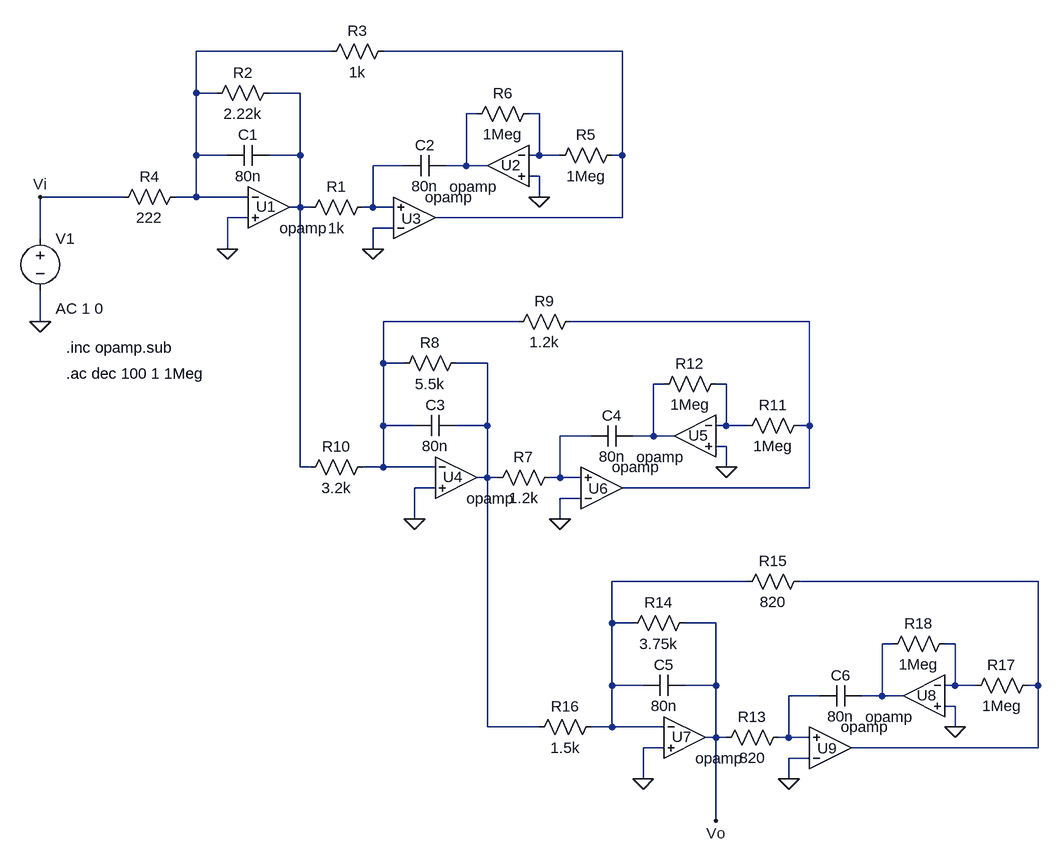
[diagram p0: schematic Ej_8.asc]
Ej_8.asc, the LTspice schematic file:
Version 4
SHEET 1 2688 1292
WIRE 208 -80 0 -80
WIRE 656 -80 288 -80
WIRE 0 -16 0 -80
WIRE 32 -16 0 -16
WIRE 160 -16 112 -16
WIRE 432 16 416 16
WIRE 528 16 512 16
WIRE 0 80 0 -16
WIRE 48 80 0 80
WIRE 160 80 160 -16
WIRE 160 80 112 80
WIRE 528 80 528 16
WIRE 528 80 512 80
WIRE 560 80 528 80
WIRE 656 80 656 -80
WIRE 656 80 640 80
WIRE 320 96 272 96
WIRE 416 96 416 16
WIRE 416 96 384 96
WIRE 448 96 416 96
WIRE 528 112 512 112
WIRE -112 144 -240 144
WIRE 0 144 0 80
WIRE 0 144 -32 144
WIRE 80 144 0 144
WIRE 528 144 528 112
WIRE 160 160 160 80
WIRE 160 160 144 160
WIRE 176 160 160 160
WIRE 272 160 272 96
WIRE 272 160 256 160
WIRE 304 160 272 160
WIRE 80 176 48 176
WIRE 656 176 656 80
WIRE 656 176 368 176
WIRE 304 192 272 192
WIRE -240 208 -240 144
WIRE 48 224 48 176
WIRE 272 224 272 192
WIRE -240 336 -240 288
WIRE 496 336 288 336
WIRE 944 336 576 336
WIRE 288 400 288 336
WIRE 320 400 288 400
WIRE 448 400 400 400
WIRE 720 432 704 432
WIRE 816 432 800 432
WIRE 288 496 288 400
WIRE 336 496 288 496
WIRE 448 496 448 400
WIRE 448 496 400 496
WIRE 816 496 816 432
WIRE 816 496 800 496
WIRE 848 496 816 496
WIRE 944 496 944 336
WIRE 944 496 928 496
WIRE 608 512 560 512
WIRE 704 512 704 432
WIRE 704 512 672 512
WIRE 736 512 704 512
WIRE 816 528 800 528
WIRE 160 560 160 160
WIRE 176 560 160 560
WIRE 288 560 288 496
WIRE 288 560 256 560
WIRE 368 560 288 560
WIRE 816 560 816 528
WIRE 448 576 448 496
WIRE 448 576 432 576
WIRE 464 576 448 576
WIRE 560 576 560 512
WIRE 560 576 544 576
WIRE 592 576 560 576
WIRE 368 592 336 592
WIRE 944 592 944 496
WIRE 944 592 656 592
WIRE 592 608 560 608
WIRE 336 640 336 592
WIRE 560 640 560 608
WIRE 848 736 640 736
WIRE 1296 736 928 736
WIRE 640 800 640 736
WIRE 672 800 640 800
WIRE 800 800 752 800
WIRE 1072 832 1056 832
WIRE 1168 832 1152 832
WIRE 640 896 640 800
WIRE 688 896 640 896
WIRE 800 896 800 800
WIRE 800 896 752 896
WIRE 1168 896 1168 832
WIRE 1168 896 1152 896
WIRE 1200 896 1168 896
WIRE 1296 896 1296 736
WIRE 1296 896 1280 896
WIRE 960 912 912 912
WIRE 1056 912 1056 832
WIRE 1056 912 1024 912
WIRE 1088 912 1056 912
WIRE 1168 928 1152 928
WIRE 448 960 448 576
WIRE 528 960 448 960
WIRE 640 960 640 896
WIRE 640 960 608 960
WIRE 720 960 640 960
WIRE 1168 960 1168 928
WIRE 800 976 800 896
WIRE 800 976 784 976
WIRE 816 976 800 976
WIRE 912 976 912 912
WIRE 912 976 896 976
WIRE 944 976 912 976
WIRE 720 992 688 992
WIRE 1296 992 1296 896
WIRE 1296 992 1008 992
WIRE 944 1008 912 1008
WIRE 688 1040 688 992
WIRE 912 1040 912 1008
WIRE 800 1104 800 976
FLAG 48 224 0
FLAG 272 224 0
FLAG 528 144 0
FLAG 336 640 0
FLAG 560 640 0
FLAG 816 560 0
FLAG 688 1040 0
FLAG 912 1040 0
FLAG 1168 960 0
FLAG 800 1104 Vo
FLAG -240 336 0
FLAG -240 144 Vi
SYMBOL OpAmps\\opamp 112 96 R0
WINDOW 0 -20 63 Left 2
SYMATTR InstName U1
SYMBOL voltage -240 192 R0
WINDOW 123 24 124 Left 2
WINDOW 39 0 0 Left 0
SYMATTR Value2 AC 1 0
SYMATTR InstName V1
SYMATTR Value ""
SYMBOL OpAmps\\opamp 480 32 M0
WINDOW 0 -20 63 Left 2
SYMATTR InstName U2
SYMBOL OpAmps\\opamp 336 240 M180
WINDOW 0 -20 63 Left 2
SYMATTR InstName U3
SYMBOL res 272 144 R90
WINDOW 0 0 56 VBottom 2
WINDOW 3 32 56 VTop 2
SYMATTR InstName R1
SYMATTR Value 1k
SYMBOL cap 112 64 R90
WINDOW 0 0 32 VBottom 2
WINDOW 3 32 32 VTop 2
SYMATTR InstName C1
SYMATTR Value 80n
SYMBOL res 128 -32 R90
WINDOW 0 0 56 VBottom 2
WINDOW 3 32 56 VTop 2
SYMATTR InstName R2
SYMATTR Value 2.22k
SYMBOL res 304 -96 R90
WINDOW 0 0 56 VBottom 2
WINDOW 3 32 56 VTop 2
SYMATTR InstName R3
SYMATTR Value 1k
SYMBOL res -16 128 R90
WINDOW 0 0 56 VBottom 2
WINDOW 3 32 56 VTop 2
SYMATTR InstName R4
SYMATTR Value 222
SYMBOL res 656 64 R90
WINDOW 0 0 56 VBottom 2
WINDOW 3 32 56 VTop 2
SYMATTR InstName R5
SYMATTR Value 1Meg
SYMBOL res 528 0 R90
WINDOW 0 0 56 VBottom 2
WINDOW 3 32 56 VTop 2
SYMATTR InstName R6
SYMATTR Value 1Meg
SYMBOL cap 384 80 R90
WINDOW 0 0 32 VBottom 2
WINDOW 3 32 32 VTop 2
SYMATTR InstName C2
SYMATTR Value 80n
SYMBOL OpAmps\\opamp 400 512 R0
WINDOW 0 -20 63 Left 2
SYMATTR InstName U4
SYMBOL OpAmps\\opamp 768 448 M0
WINDOW 0 -20 63 Left 2
SYMATTR InstName U5
SYMBOL OpAmps\\opamp 624 656 M180
WINDOW 0 -20 63 Left 2
SYMATTR InstName U6
SYMBOL res 560 560 R90
WINDOW 0 0 56 VBottom 2
WINDOW 3 32 56 VTop 2
SYMATTR InstName R7
SYMATTR Value 1.2k
SYMBOL cap 400 480 R90
WINDOW 0 0 32 VBottom 2
WINDOW 3 32 32 VTop 2
SYMATTR InstName C3
SYMATTR Value 80n
SYMBOL res 416 384 R90
WINDOW 0 0 56 VBottom 2
WINDOW 3 32 56 VTop 2
SYMATTR InstName R8
SYMATTR Value 5.5k
SYMBOL res 592 320 R90
WINDOW 0 0 56 VBottom 2
WINDOW 3 32 56 VTop 2
SYMATTR InstName R9
SYMATTR Value 1.2k
SYMBOL res 272 544 R90
WINDOW 0 0 56 VBottom 2
WINDOW 3 32 56 VTop 2
SYMATTR InstName R10
SYMATTR Value 3.2k
SYMBOL res 944 480 R90
WINDOW 0 0 56 VBottom 2
WINDOW 3 32 56 VTop 2
SYMATTR InstName R11
SYMATTR Value 1Meg
SYMBOL res 816 416 R90
WINDOW 0 0 56 VBottom 2
WINDOW 3 32 56 VTop 2
SYMATTR InstName R12
SYMATTR Value 1Meg
SYMBOL cap 672 496 R90
WINDOW 0 0 32 VBottom 2
WINDOW 3 32 32 VTop 2
SYMATTR InstName C4
SYMATTR Value 80n
SYMBOL OpAmps\\opamp 752 912 R0
WINDOW 0 -20 63 Left 2
SYMATTR InstName U7
SYMBOL OpAmps\\opamp 1120 848 M0
WINDOW 0 -20 63 Left 2
SYMATTR InstName U8
SYMBOL OpAmps\\opamp 976 1056 M180
WINDOW 0 -20 63 Left 2
SYMATTR InstName U9
SYMBOL res 912 960 R90
WINDOW 0 0 56 VBottom 2
WINDOW 3 32 56 VTop 2
SYMATTR InstName R13
SYMATTR Value 820
SYMBOL cap 752 880 R90
WINDOW 0 0 32 VBottom 2
WINDOW 3 32 32 VTop 2
SYMATTR InstName C5
SYMATTR Value 80n
SYMBOL res 768 784 R90
WINDOW 0 0 56 VBottom 2
WINDOW 3 32 56 VTop 2
SYMATTR InstName R14
SYMATTR Value 3.75k
SYMBOL res 944 720 R90
WINDOW 0 0 56 VBottom 2
WINDOW 3 32 56 VTop 2
SYMATTR InstName R15
SYMATTR Value 820
SYMBOL res 624 944 R90
WINDOW 0 0 56 VBottom 2
WINDOW 3 32 56 VTop 2
SYMATTR InstName R16
SYMATTR Value 1.5k
SYMBOL res 1296 880 R90
WINDOW 0 0 56 VBottom 2
WINDOW 3 32 56 VTop 2
SYMATTR InstName R17
SYMATTR Value 1Meg
SYMBOL res 1168 816 R90
WINDOW 0 0 56 VBottom 2
WINDOW 3 32 56 VTop 2
SYMATTR InstName R18
SYMATTR Value 1Meg
SYMBOL cap 1024 896 R90
WINDOW 0 0 32 VBottom 2
WINDOW 3 32 32 VTop 2
SYMATTR InstName C6
SYMATTR Value 80n
TEXT -200 376 Left 2 !.inc opamp.sub
TEXT -200 416 Left 2 !.ac dec 100 1 1Meg

The netlist it stands for:
* Ej_8.asc
XU1 N001 0 N003 opamp Aol=100K GBW=10Meg  ; pins invin noninvin out
V1 Vi 0 AC 1 0
XU2 N005 0 N004 opamp Aol=100K GBW=10Meg  ; pins invin noninvin out
XU3 0 N006 N002 opamp Aol=100K GBW=10Meg  ; pins invin noninvin out
R1 N006 N003 1k
C1 N003 N001 80n
R2 N003 N001 2.22k
R3 N002 N001 1k
R4 N001 Vi 222
R5 N002 N005 1Meg
R6 N005 N004 1Meg
C2 N004 N006 80n
XU4 N007 0 N009 opamp Aol=100K GBW=10Meg  ; pins invin noninvin out
XU5 N011 0 N010 opamp Aol=100K GBW=10Meg  ; pins invin noninvin out
XU6 0 N012 N008 opamp Aol=100K GBW=10Meg  ; pins invin noninvin out
R7 N012 N009 1.2k
C3 N009 N007 80n
R8 N009 N007 5.5k
R9 N008 N007 1.2k
R10 N007 N003 3.2k
R11 N008 N011 1Meg
R12 N011 N010 1Meg
C4 N010 N012 80n
XU7 N013 0 Vo opamp Aol=100K GBW=10Meg  ; pins invin noninvin out
XU8 N016 0 N015 opamp Aol=100K GBW=10Meg  ; pins invin noninvin out
XU9 0 N017 N014 opamp Aol=100K GBW=10Meg  ; pins invin noninvin out
R13 N017 Vo 820
C5 Vo N013 80n
R14 Vo N013 3.75k
R15 N014 N013 820
R16 N013 N009 1.5k
R17 N014 N016 1Meg
R18 N016 N015 1Meg
C6 N015 N017 80n
.inc opamp.sub
.ac dec 100 1 1Meg
.backanno
.end